# Altium schematic sheet Page K_B2B_D.SchDoc
size 386 x 246 mm; SheetNumber: 0; SheetTotal: 0
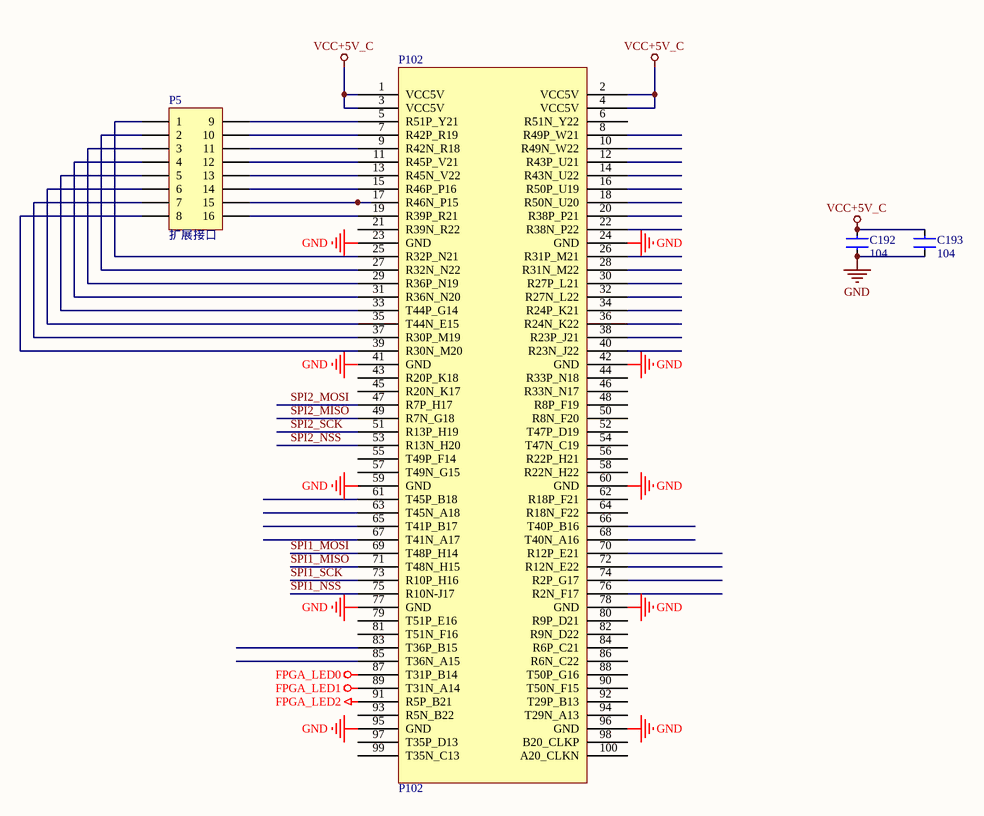
[diagram p0: Page K_B2B_D.SchDoc]

## Parts
C192  104  [0603C]
C193  104  [0603C]
P5  扩展接口  [HDR2X8_CEN]
P102  P102  [IDC100-05MM-SMD]

## Nets
FPGA_LED0: P102.87(T31P_B14)
FPGA_LED1: P102.89(T31N_A14)
FPGA_LED2: P102.91(R5P_B21)
GND: C192.1 C193.1 P102.23(GND) P102.24(GND) P102.41(GND) P102.42(GND) P102.59(GND) P102.60(GND) P102.77(GND) P102.78(GND) P102.95(GND) P102.96(GND)
VCC+5V_C: C192.2 C193.2 P102.1(VCC5V) P102.2(VCC5V) P102.3(VCC5V) P102.4(VCC5V)
SPI1_MISO: P102.71(T48N_H15)
SPI1_MOSI: P102.69(T48P_H14)
SPI1_NSS: P102.75(R10N-J17)
SPI1_SCK: P102.73(R10P_H16)
SPI2_MISO: P102.49(R7N_G18)
SPI2_MOSI: P102.47(R7P_H17)
SPI2_NSS: P102.53(R13N_H20)
SPI2_SCK: P102.51(R13P_H19)
NetP5_1: P5.1 P102.25(R32P_N21)
NetP5_2: P5.2 P102.27(R32N_N22)
NetP5_3: P5.3 P102.29(R36P_N19)
NetP5_4: P5.4 P102.31(R36N_N20)
NetP5_5: P5.5 P102.33(T44P_G14)
NetP5_6: P5.6 P102.35(T44N_E15)
NetP5_7: P5.7 P102.37(R30P_M19)
NetP5_8: P5.8 P102.39(R30N_M20)
NetP5_9: P5.9 P102.5(R51P_Y21)
NetP5_10: P5.10 P102.7(R42P_R19)
NetP5_11: P5.11 P102.9(R42N_R18)
NetP5_12: P5.12 P102.11(R45P_V21)
NetP5_13: P5.13 P102.13(R45N_V22)
NetP5_14: P5.14 P102.15(R46P_P16)
NetP5_15: P5.15 P102.17(R46N_P15)
NetP5_16: P5.16 P102.19(R39P_R21)

Not connected (* = marked no-connect by the designer): P102 6(R51N_Y22) 8(R49P_W21) 10(R49N_W22) 12(R43P_U21) 14(R43N_U22) 16(R50P_U19) 18(R50N_U20) 20(R38P_P21) 21(R39N_R22) 22(R38N_P22) 26(R31P_M21) 28(R31N_M22) 30(R27P_L21) 32(R27N_L22) 34(R24P_K21) 36(R24N_K22) 38(R23P_J21) 40(R23N_J22) 43(R20P_K18) 44(R33P_N18) 45(R20N_K17) 46(R33N_N17) 48(R8P_F19) 50(R8N_F20) 52(T47P_D19) 54(T47N_C19) 55(T49P_F14) 56(R22P_H21) 57(T49N_G15) 58(R22N_H22) 61(T45P_B18) 62(R18P_F21) 63(T45N_A18) 64(R18N_F22) 65(T41P_B17) 66(T40P_B16) 67(T41N_A17) 68(T40N_A16) 70(R12P_E21) 72(R12N_E22) 74(R2P_G17) 76(R2N_F17) 79(T51P_E16) 80(R9P_D21) 81(T51N_F16) 82(R9N_D22) 83(T36P_B15) 84(R6P_C21) 85(T36N_A15) 86(R6N_C22) 88(T50P_G16) 90(T50N_F15) 92(T29P_B13) 93(R5N_B22) 94(T29N_A13) 97(T35P_D13) 98(B20_CLKP) 99(T35N_C13) 100(A20_CLKN)

## Library data of the parts
C192 C193 = C-X5R/X7R
P5 = Header 8X2A: Header, 8-Pin, Dual row; LatestRevisionDate: 17-Jul-2002; LatestRevisionNote: Re-released for DXP Platform.; Publisher: Altium Limited
P102 = IDC102